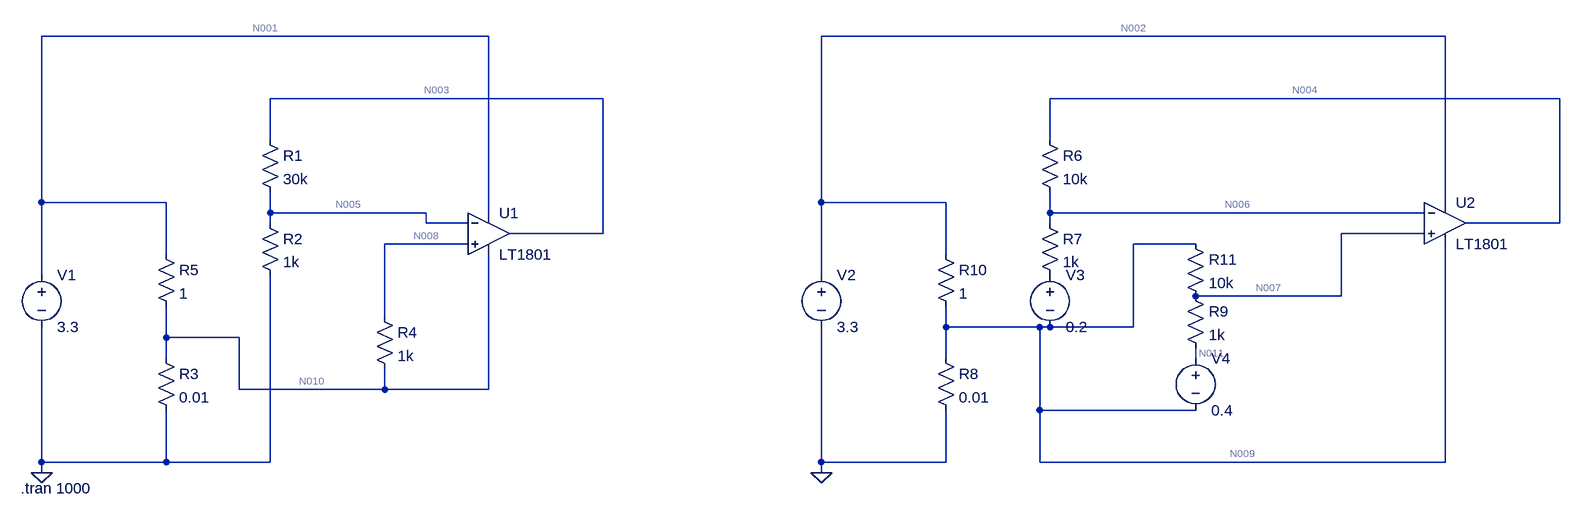
[diagram p0: schematic Op amps.asc]
Op amps.asc, the LTspice schematic file:
Version 4
SHEET 1 2152 680
WIRE 496 -336 -192 -336
WIRE 1968 -336 1008 -336
WIRE 672 -240 160 -240
WIRE 2144 -240 1360 -240
WIRE 160 -176 160 -240
WIRE 1360 -176 1360 -240
WIRE -192 -80 -192 -336
WIRE 0 -80 -192 -80
WIRE 1008 -80 1008 -336
WIRE 1200 -80 1008 -80
WIRE 1968 -80 1968 -336
WIRE 160 -64 160 -96
WIRE 400 -64 160 -64
WIRE 496 -64 496 -336
WIRE 1360 -64 1360 -96
WIRE 1936 -64 1360 -64
WIRE 160 -48 160 -64
WIRE 400 -48 400 -64
WIRE 464 -48 400 -48
WIRE 1360 -48 1360 -64
WIRE 2144 -48 2144 -240
WIRE 2144 -48 2000 -48
WIRE 672 -32 672 -240
WIRE 672 -32 528 -32
WIRE 1936 -32 1808 -32
WIRE 464 -16 336 -16
WIRE 1584 -16 1488 -16
WIRE 0 0 0 -80
WIRE 1200 0 1200 -80
WIRE -192 32 -192 -80
WIRE 1008 32 1008 -80
WIRE 1808 64 1808 -32
WIRE 1808 64 1584 64
WIRE 336 96 336 -16
WIRE 1200 112 1200 80
WIRE 1344 112 1200 112
WIRE 1360 112 1344 112
WIRE 1488 112 1488 -16
WIRE 1488 112 1360 112
WIRE 0 128 0 80
WIRE 112 128 0 128
WIRE 0 160 0 128
WIRE 1200 160 1200 112
WIRE 1584 160 1584 144
WIRE 112 208 112 128
WIRE 336 208 336 176
WIRE 336 208 112 208
WIRE 496 208 496 0
WIRE 496 208 336 208
WIRE 1344 240 1344 112
WIRE 1584 240 1344 240
WIRE -192 320 -192 112
WIRE 0 320 0 240
WIRE 0 320 -192 320
WIRE 160 320 160 32
WIRE 160 320 0 320
WIRE 1008 320 1008 112
WIRE 1200 320 1200 240
WIRE 1200 320 1008 320
WIRE 1344 320 1344 240
WIRE 1968 320 1968 -16
WIRE 1968 320 1344 320
WIRE -192 336 -192 320
WIRE 1008 336 1008 320
FLAG -192 336 0
FLAG 1008 336 0
SYMBOL res 144 -192 R0
SYMATTR InstName R1
SYMATTR Value 30k
SYMBOL res 144 -64 R0
SYMATTR InstName R2
SYMATTR Value 1k
SYMBOL voltage -192 16 R0
WINDOW 123 0 0 Left 0
WINDOW 39 0 0 Left 0
SYMATTR InstName V1
SYMATTR Value 3.3
SYMBOL Opamps\\LT1801 496 -32 R0
SYMATTR InstName U1
SYMBOL res -16 144 R0
SYMATTR InstName R3
SYMATTR Value 0.01
SYMBOL res 320 80 R0
SYMATTR InstName R4
SYMATTR Value 1k
SYMBOL res -16 -16 R0
SYMATTR InstName R5
SYMATTR Value 1
SYMBOL res 1344 -192 R0
SYMATTR InstName R6
SYMATTR Value 10k
SYMBOL res 1344 -64 R0
SYMATTR InstName R7
SYMATTR Value 1k
SYMBOL voltage 1008 16 R0
WINDOW 123 0 0 Left 0
WINDOW 39 0 0 Left 0
SYMATTR InstName V2
SYMATTR Value 3.3
SYMBOL Opamps\\LT1801 1968 -48 R0
SYMATTR InstName U2
SYMBOL res 1184 144 R0
SYMATTR InstName R8
SYMATTR Value 0.01
SYMBOL res 1184 -16 R0
SYMATTR InstName R10
SYMATTR Value 1
SYMBOL voltage 1360 16 R0
WINDOW 123 0 0 Left 0
WINDOW 39 0 0 Left 0
SYMATTR InstName V3
SYMATTR Value 0.2
SYMBOL voltage 1584 144 R0
WINDOW 123 0 0 Left 0
WINDOW 39 0 0 Left 0
SYMATTR InstName V4
SYMATTR Value 0.4
SYMBOL res 1568 48 R0
SYMATTR InstName R9
SYMATTR Value 1k
SYMBOL res 1568 -32 R0
SYMATTR InstName R11
SYMATTR Value 10k
TEXT -224 360 Left 2 !.tran 1000

The netlist it stands for:
* Op amps.asc
R1 N003 N005 30k
R2 N005 0 1k
V1 N001 0 3.3
* U1: LT1801 (symbol Opamps\LT1801 not available, pins judged from their places): In+=N008 In-=N005 V+=N001 V-=N010 OUT=N003
R3 N010 0 0.01
R4 N008 N010 1k
R5 N001 N010 1
R6 N004 N006 10k
R7 N006 P001 1k
V2 N002 0 3.3
* U2: LT1801 (symbol Opamps\LT1801 not available, pins judged from their places): In+=N007 In-=N006 V+=N002 V-=N009 OUT=N004
R8 N009 0 0.01
R10 N002 N009 1
V3 P001 N009 0.2
V4 N011 N009 0.4
R9 N007 N011 1k
R11 N009 N007 10k
.tran 1000
.backanno
.end

* Results of the author's LTspice run, read from the files saved beside the schematic
* Operating Point, zero values left out:
*   V(n003) = 1.013 V
*   V(n005) = 32.71 mV
*   V(n001) = 3.3 V
*   V(n008) = 32.71 mV
*   V(n010) = 32.69 mV
*   V(n004) = 2.033 V
*   V(n006) = 396.3 mV
*   V(p001) = 232.7 mV
*   V(n002) = 3.3 V
*   V(n007) = 396.3 mV
*   V(n009) = 32.69 mV
*   V(n011) = 432.7 mV
*   I(R11) = -36.37 µA
*   I(R9) = -36.34 µA
*   I(R10) = 3.267 A
*   I(R8) = 3.269 A
*   I(R7) = 163.7 µA
*   I(R6) = 163.6 µA
*   I(R5) = 3.267 A
*   I(R4) = 25.54 nA
*   I(R3) = 3.269 A
*   I(R2) = 32.71 µA
*   I(R1) = 32.69 µA
*   I(V4) = -36.34 µA
*   I(V3) = 163.7 µA
*   I(V2) = -3.269 A
*   I(V1) = -3.269 A
*   Ix(u1:1) = -25.54 nA
*   Ix(u1:2) = -25.54 nA
*   Ix(u1:3) = 1.497 mA
*   Ix(u1:4) = -1.464 mA
*   Ix(u1:5) = -32.69 µA
*   Ix(u2:1) = -25.43 nA
*   Ix(u2:2) = -25.43 nA
*   Ix(u2:3) = 1.557 mA
*   Ix(u2:4) = -1.394 mA
*   Ix(u2:5) = -163.6 µA